# Altium schematic sheet ControlManage.SchDoc
size A4
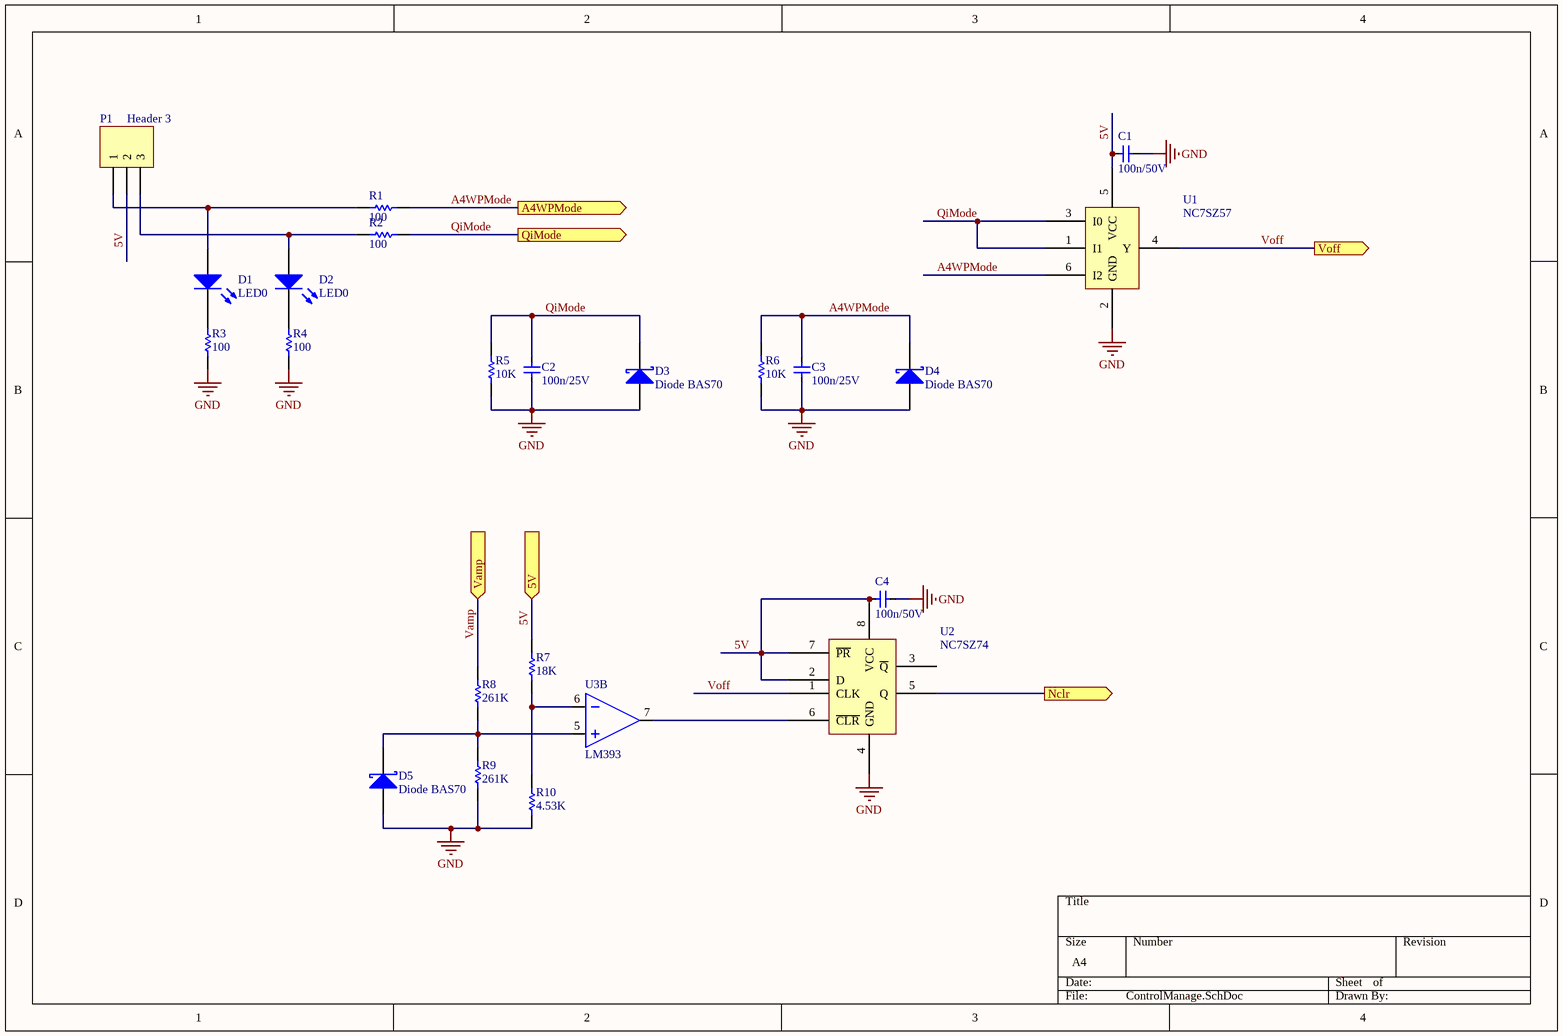
[diagram p0: ControlManage.SchDoc]

## Parts
C1  100n/50V  [0603]
C2  100n/25V  [0603]
C3  100n/25V  [0603]
C4  100n/50V  [0603]
D1  LED0  [LED0805]
D2  LED0  [LED0805]
D3  Diode BAS70  [SMA]
D4  Diode BAS70  [SMA]
D5  Diode BAS70  [SMA]
P1  Header 3  [HDR1X3]
R1  value 100  [0603]  (hidden comment: Res1)
R2  value 100  [0603]  (hidden comment: Res1)
R3  value 100  [0603]  (hidden comment: Res1)
R4  value 100  [0603]  (hidden comment: Res1)
R5  value 10K  [0603]  (hidden comment: Res1)
R6  value 10K  [0603]  (hidden comment: Res1)
R7  value 18K  [0603]  (hidden comment: Res1)
R8  value 261K  [0603]  (hidden comment: Res1)
R9  value 261K  [0603]  (hidden comment: Res1)
R10  value 4.53K  [0603]  (hidden comment: Res1)
U1  NC7SZ57  [TSOP65P220X100-6N]
U2  NC7SZ74  [TSSOP50P340X100-8N]
U3  LM393  [SO8_L]  (part B of 2)

## Ports
5V (in), A4WPMode (out), Nclr (out), QiMode (out), Vamp (in), Voff (out)

## Nets
GND: C1.1 C2.2 C3.2 C4.1 D3.1(A) D4.1(A) D5.1(A) R3.2 R4.2 R5.2 R6.2 R9.1 R10.1 U1.2(GND) U2.4(GND)
5V: C1.2 C4.2 P1.2 R7.2 U1.5(VCC) U2.2(D) U2.7(~{PR}) U2.8(VCC) ; port 5V
A4WPMode: C3.1 D4.3(K) R1.1 R6.1 U1.6(I2) ; port A4WPMode
Nclr: U2.5(Q) ; port Nclr
QiMode: C2.1 D3.3(K) R2.1 R5.1 U1.1(I1) U1.3(I0) ; port QiMode
Vamp: R8.2 ; port Vamp
Voff: U1.4(Y) U2.1(CLK) ; port Voff
NetD1_1: D1.1(A) P1.1 R1.2
NetD1_2: D1.2(K) R3.1
NetD2_1: D2.1(A) P1.3 R2.2
NetD2_2: D2.2(K) R4.1
NetD5_3: D5.3(K) R8.1 R9.2 U3.5
NetR7_1: R7.1 R10.2 U3.6
NetU2_6: U2.6(~{CLR}) U3.7

Not connected (* = marked no-connect by the designer): U2 3(~{Q})

## Library data of the parts
C1-C4 = CAP1: Capacitor
D1 D2 = LED0: Typical INFRARED GaAs LED; Published: 8-Jun-2000; LatestRevisionDate: 08-Jul-2005; LatestRevisionNote: Mech Layer 1 removed.; PackageReference: LED-0; Publisher: Altium Limited; PackageDescription: LED; 2 Leads
D3-D5 = Diode BAS70: Silicon AF Schottky Diode for High-Speed Switching; pin to pad: 3>2; Note: Pin 2 is not connected and not drawn.; Published: 21-Mar-2003; LatestRevisionDate: 29-May-2009; LatestRevisionNote: IPC-7351 Footprint Added.; DatasheetVersion: Oct-1999; PackageVersion: Sep-2001; PackageReference: SOT-23; Publisher: Altium Limited; PackageDescription: 3-Pin SOT-23 Package 0.95 mm Pitch, 2.5 mm Lead Span; ComponentLink1Description: Manufacturer Link; ComponentLink1URL: http://www.infineon.com/; ComponentLink2Description: Datasheet; ComponentLink2URL: http://www.infineon.com/upload/Document/cmc_upload/documents/009/382/bas40_bas140series_1.pdf
P1 = Header 3: Header, 3-Pin; LatestRevisionDate: 17-Jul-2002; LatestRevisionNote: Re-released for DXP Platform.; Publisher: Altium Limited
R1-R10 = Res1: Resistor; Published: 8-Jun-2000; LatestRevisionDate: 17-Jul-2002; LatestRevisionNote: Re-released for DXP Platform.; PackageReference: AXIAL-0.3; Publisher: Altium Limited; PackageDescription: Axial Device, Thru-Hole; 2 Leads; 0.3 in Pin Spacing